# EAGLE design captouch (EAGLE 6.4)
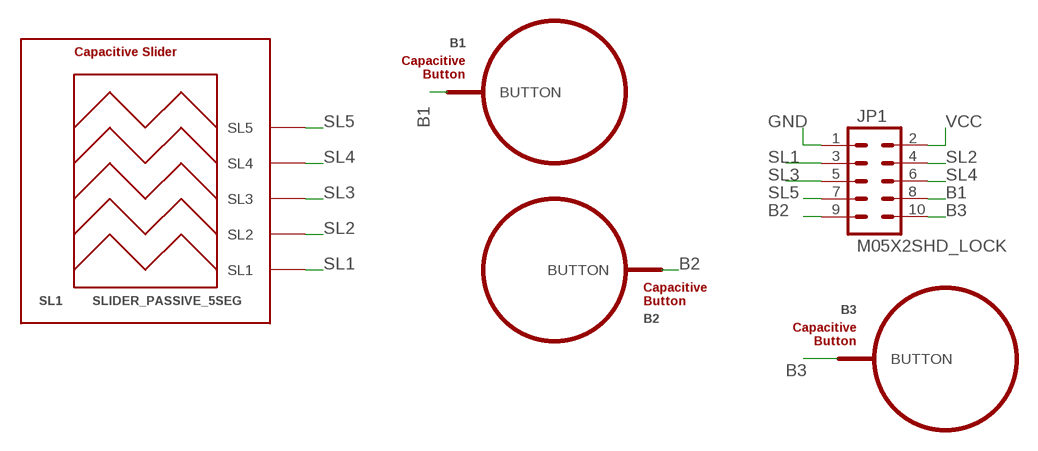
[diagram p0: schematic, sheet 1]

## Parts
B1  BUTTON_PASSIVE10MM  [BUTTON_PASSIVE_10MM]
B2  BUTTON_PASSIVE10MM  [BUTTON_PASSIVE_10MM]
B3  BUTTON_PASSIVE12MM  [BUTTON_PASSIVE_12MM]
JP1  M05X2SHD_LOCK  [2X5-SHROUDED_LOCK]
SL1  SLIDER_PASSIVE_5SEG  [SLIDER_PASSIVE_5SEG_12MM]

## Nets
B1: B1.BUTTON JP1.8
B2: B2.BUTTON JP1.9
B3: B3.BUTTON JP1.10
GND: JP1.1
SL1: JP1.3 SL1.SL1
SL2: JP1.4 SL1.SL2
SL3: JP1.5 SL1.SL3
SL4: JP1.6 SL1.SL4
SL5: JP1.7 SL1.SL5
VCC: JP1.2

## Library data of the parts
B1-B3 = PatternAgents-TouchWidgets:BUTTON_PASSIVE: Button, Passive Capacitive/Touch Sensing Type Source : http://www.PatternAgents.com Github : https://github.com/PatternAgents License : http://creativecommons.org/licenses/by-sa/3.1/ (Creative Commons 3.1) THIS SOFTWARE IS PROVIDED BY THE CONTRIBUTORS "AS IS" AND WITHOUT ANY EXPRESS OR IMPLIED WARRANTIES, INCLUDING, BUT NOT LIMITED TO, THE IMPLIED WARRANTIES OF MERCHANTABILITY AND FITNESS FOR A PARTICULAR PURPOSE ARE DISCLAIMED. IN NO EVENT SHALL THE COPYRIGHT OWNER OR CONTRIBUTORS BE LIABLE FOR ANY DIRECT, INDIRECT, INCIDENTAL, SPECIAL, EXEMPLARY, OR CONSEQUENTIAL DAMAGES (INCLUDING, BUT NOT LIMITED TO, PROCUREMENT OF SUBSTITUTE GOODS OR SERVICES; LOSS OF USE, DATA, OR PROFITS; OR BUSINESS INTERRUPTION) HOWEVER CAUSED AND ON ANY THEORY OF LIABILITY, WHETHER IN CONTRACT, STRICT LIABILITY, OR TORT (INCLUDING NEGLIGENCE OR OTHERWISE) ARISING IN ANY WAY OUT OF THE USE OF THIS SOFTWARE, EVEN IF ADVISED OF THE POSSIBILITY OF SUCH DAMAGE.
JP1 = SparkFun-Connectors:M05X2: Header 5x2 Standard 10-pin dual row 0.1" header. Commonly used with AVR-ISP. Use with Spark Fun Electronics SKU: PRT-00778
SL1 = PatternAgents-TouchWidgets:SLIDER_PASSIVE_5SEG: Slider, Passive Touch/Capacitive Sensing Type, Five (5) Segment Source : http://www.PatternAgents.com Github : https://github.com/PatternAgents License : http://creativecommons.org/licenses/by-sa/3.1/ (Creative Commons 3.1) THIS SOFTWARE IS PROVIDED BY THE CONTRIBUTORS "AS IS" AND WITHOUT ANY EXPRESS OR IMPLIED WARRANTIES, INCLUDING, BUT NOT LIMITED TO, THE IMPLIED WARRANTIES OF MERCHANTABILITY AND FITNESS FOR A PARTICULAR PURPOSE ARE DISCLAIMED. IN NO EVENT SHALL THE COPYRIGHT OWNER OR CONTRIBUTORS BE LIABLE FOR ANY DIRECT, INDIRECT, INCIDENTAL, SPECIAL, EXEMPLARY, OR CONSEQUENTIAL DAMAGES (INCLUDING, BUT NOT LIMITED TO, PROCUREMENT OF SUBSTITUTE GOODS OR SERVICES; LOSS OF USE, DATA, OR PROFITS; OR BUSINESS INTERRUPTION) HOWEVER CAUSED AND ON ANY THEORY OF LIABILITY, WHETHER IN CONTRACT, STRICT LIABILITY, OR TORT (INCLUDING NEGLIGENCE OR OTHERWISE) ARISING IN ANY WAY OUT OF THE USE OF THIS SOFTWARE, EVEN IF ADVISED OF THE POSSIBILITY OF SUCH DAMAGE.

## Board
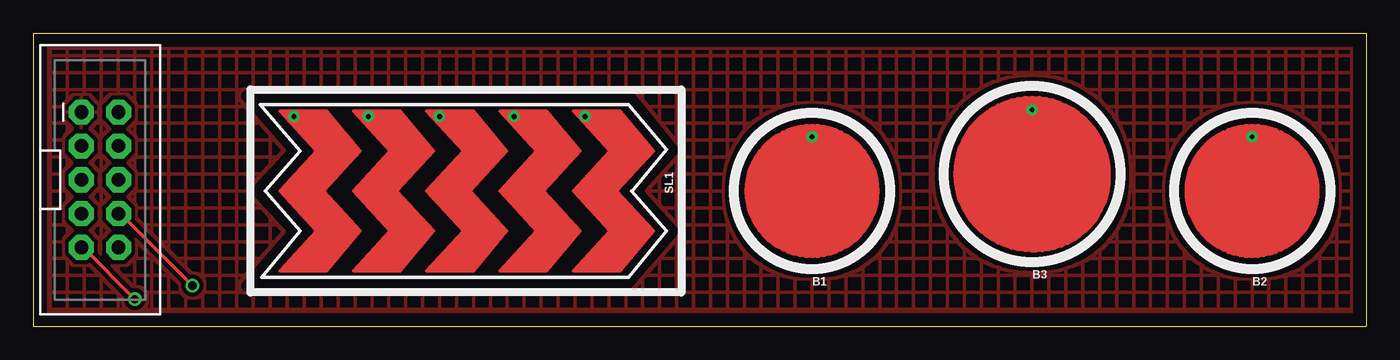
[diagram p1: board, top side]
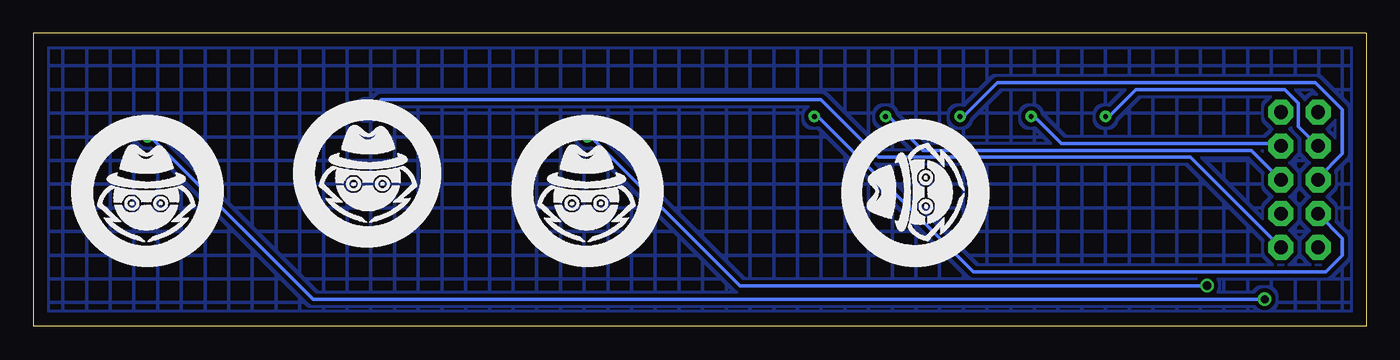
[diagram p2: board, bottom side, seen from below]

Size 100 x 22 mm. Coordinates in mm from the lower left corner, seen from the top.
Outline: 0,0 100,0 100,22 0,22 0,0
Copper layers (1*16): Top 0.035mm / dielectric 1.5mm / Bottom 0.035mm
Design rules "default": minimum track width 10mil, minimum drill 24mil, track to track 8mil, track to pad 8mil, pad to pad 8mil, via to via 8mil, smd to smd 8mil, copper to edge 40mil, drill to drill 8mil, minimum pad ring 10mil, minimum via ring 8mil, stop-mask expansion 4mil, vias tented up to drill 0mil, thermal gap 10mil

### Footprints (pad centres in the part's own frame; a part is rotated, then mirrored left to right if it is on the bottom)
BUTTON_PASSIVE_10MM = drill 0.356: BUTTON 0,4.064
BUTTON_PASSIVE_12MM = drill 0.356: BUTTON 0,4.826
2X5-SHROUDED_LOCK = drill 1.016 pad 1.88 octagon: 1 -1.397,5.08; 2 1.397,5.08; 3 -1.397,2.54; 4 1.397,2.54; 5 -1.397,0; 6 1.397,0; 7 -1.397,-2.54; 8 1.397,-2.54; 9 -1.397,-5.08; 10 1.397,-5.08
SLIDER_PASSIVE_5SEG_12MM = drill 0.356: SL1 -5.588,-13.462; SL2 -5.588,-7.874; SL3 -5.588,-2.54; SL4 -5.588,3.048; SL5 -5.588,8.382

### Placement (x,y rotation side)
B1  58.42,10.16 0 top
B2  91.44,10.16 0 top
B3  74.93,11.43 0 top
JP1  5,11 0 top
SL1  33.02,10.16 270 top

### Tracks (layer width: path | path; a pad name or v marks a point on that pad's centre or on a via)
B1  (via drill 0.61)
  Top 0.254: v11.94,3.05 6.6,8.38 JP1.8
  Bottom 0.254: v11.94,3.05 46.99,3.05 58.17,14.22 B1.BUTTON
B2  (via drill 0.61)
  Top 0.254: v7.62,2.03 3.81,5.84 JP1.9
  Bottom 0.254: v7.62,2.03 78.99,2.03 91.19,14.22 B2.BUTTON
B3
  Bottom 0.254: B3.BUTTON 74.68,16.26 73.91,17.02 40.89,17.02 36.58,12.7 13.21,12.7 6.6,6.1 JP1.10
GND
  pour Top (isolate 0.305, hatched): 0,21.59 99.06,21.59 99.06,0 0,0
N$1
  pour Bottom (isolate 0.305, hatched): 0,22.86 100.33,22.86 100.33,0 0,0
SL1
  Bottom 0.254: SL1.SL1 19.3,15.75 17.27,17.78 6.1,17.78 5.08,16.76 5.08,14.99 3.81,13.72 JP1.3
SL2
  Bottom 0.254: SL1.SL2 24.89,15.75 22.86,13.72 6.6,13.72 JP1.4
SL3
  Bottom 0.254: SL1.SL3 30.23,15.75 27.69,18.29 3.81,18.29 1.78,16.26 1.78,12.95 3.56,11.18 JP1.5
SL4
  Bottom 0.254: SL1.SL4 35.81,15.75 33.27,13.21 8.64,13.21 6.6,11.18 JP1.6
SL5
  Bottom 0.254: SL1.SL5 41.15,15.75 29.46,4.06 3.05,4.06 1.78,5.33 1.78,6.6 3.56,8.38 JP1.7